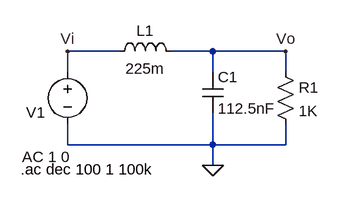
[diagram p0: schematic Ej1.asc]
Ej1.asc, the LTspice schematic file:
Version 4
SHEET 1 880 680
WIRE 80 112 0 112
WIRE 224 112 160 112
WIRE 336 112 224 112
WIRE 0 144 0 112
WIRE 224 144 224 112
WIRE 336 144 336 112
WIRE 0 256 0 224
WIRE 224 256 224 208
WIRE 224 256 0 256
WIRE 336 256 336 224
WIRE 336 256 224 256
WIRE 224 288 224 256
FLAG 224 288 0
FLAG 0 112 Vi
FLAG 336 112 Vo
SYMBOL ind 64 128 R270
WINDOW 0 32 56 VTop 2
WINDOW 3 5 56 VBottom 2
SYMATTR InstName L1
SYMATTR Value 225m
SYMBOL cap 208 144 R0
SYMATTR InstName C1
SYMATTR Value 112.5nF
SYMBOL res 320 128 R0
SYMATTR InstName R1
SYMATTR Value 1K
SYMBOL voltage 0 128 R0
WINDOW 0 -64 78 Left 2
WINDOW 123 -70 147 Left 2
WINDOW 39 0 0 Left 0
SYMATTR InstName V1
SYMATTR Value ""
SYMATTR Value2 AC 1 0
TEXT -72 294 Left 2 !.ac dec 100 1 100k

The netlist it stands for:
* Ej1.asc
L1 Vi Vo 225m
C1 Vo 0 112.5nF
R1 Vo 0 1K
V1 Vi 0 AC 1 0
.ac dec 100 1 100k
.backanno
.end